# Altium schematic sheet Connectors.SchDoc
size 420 x 297 mm
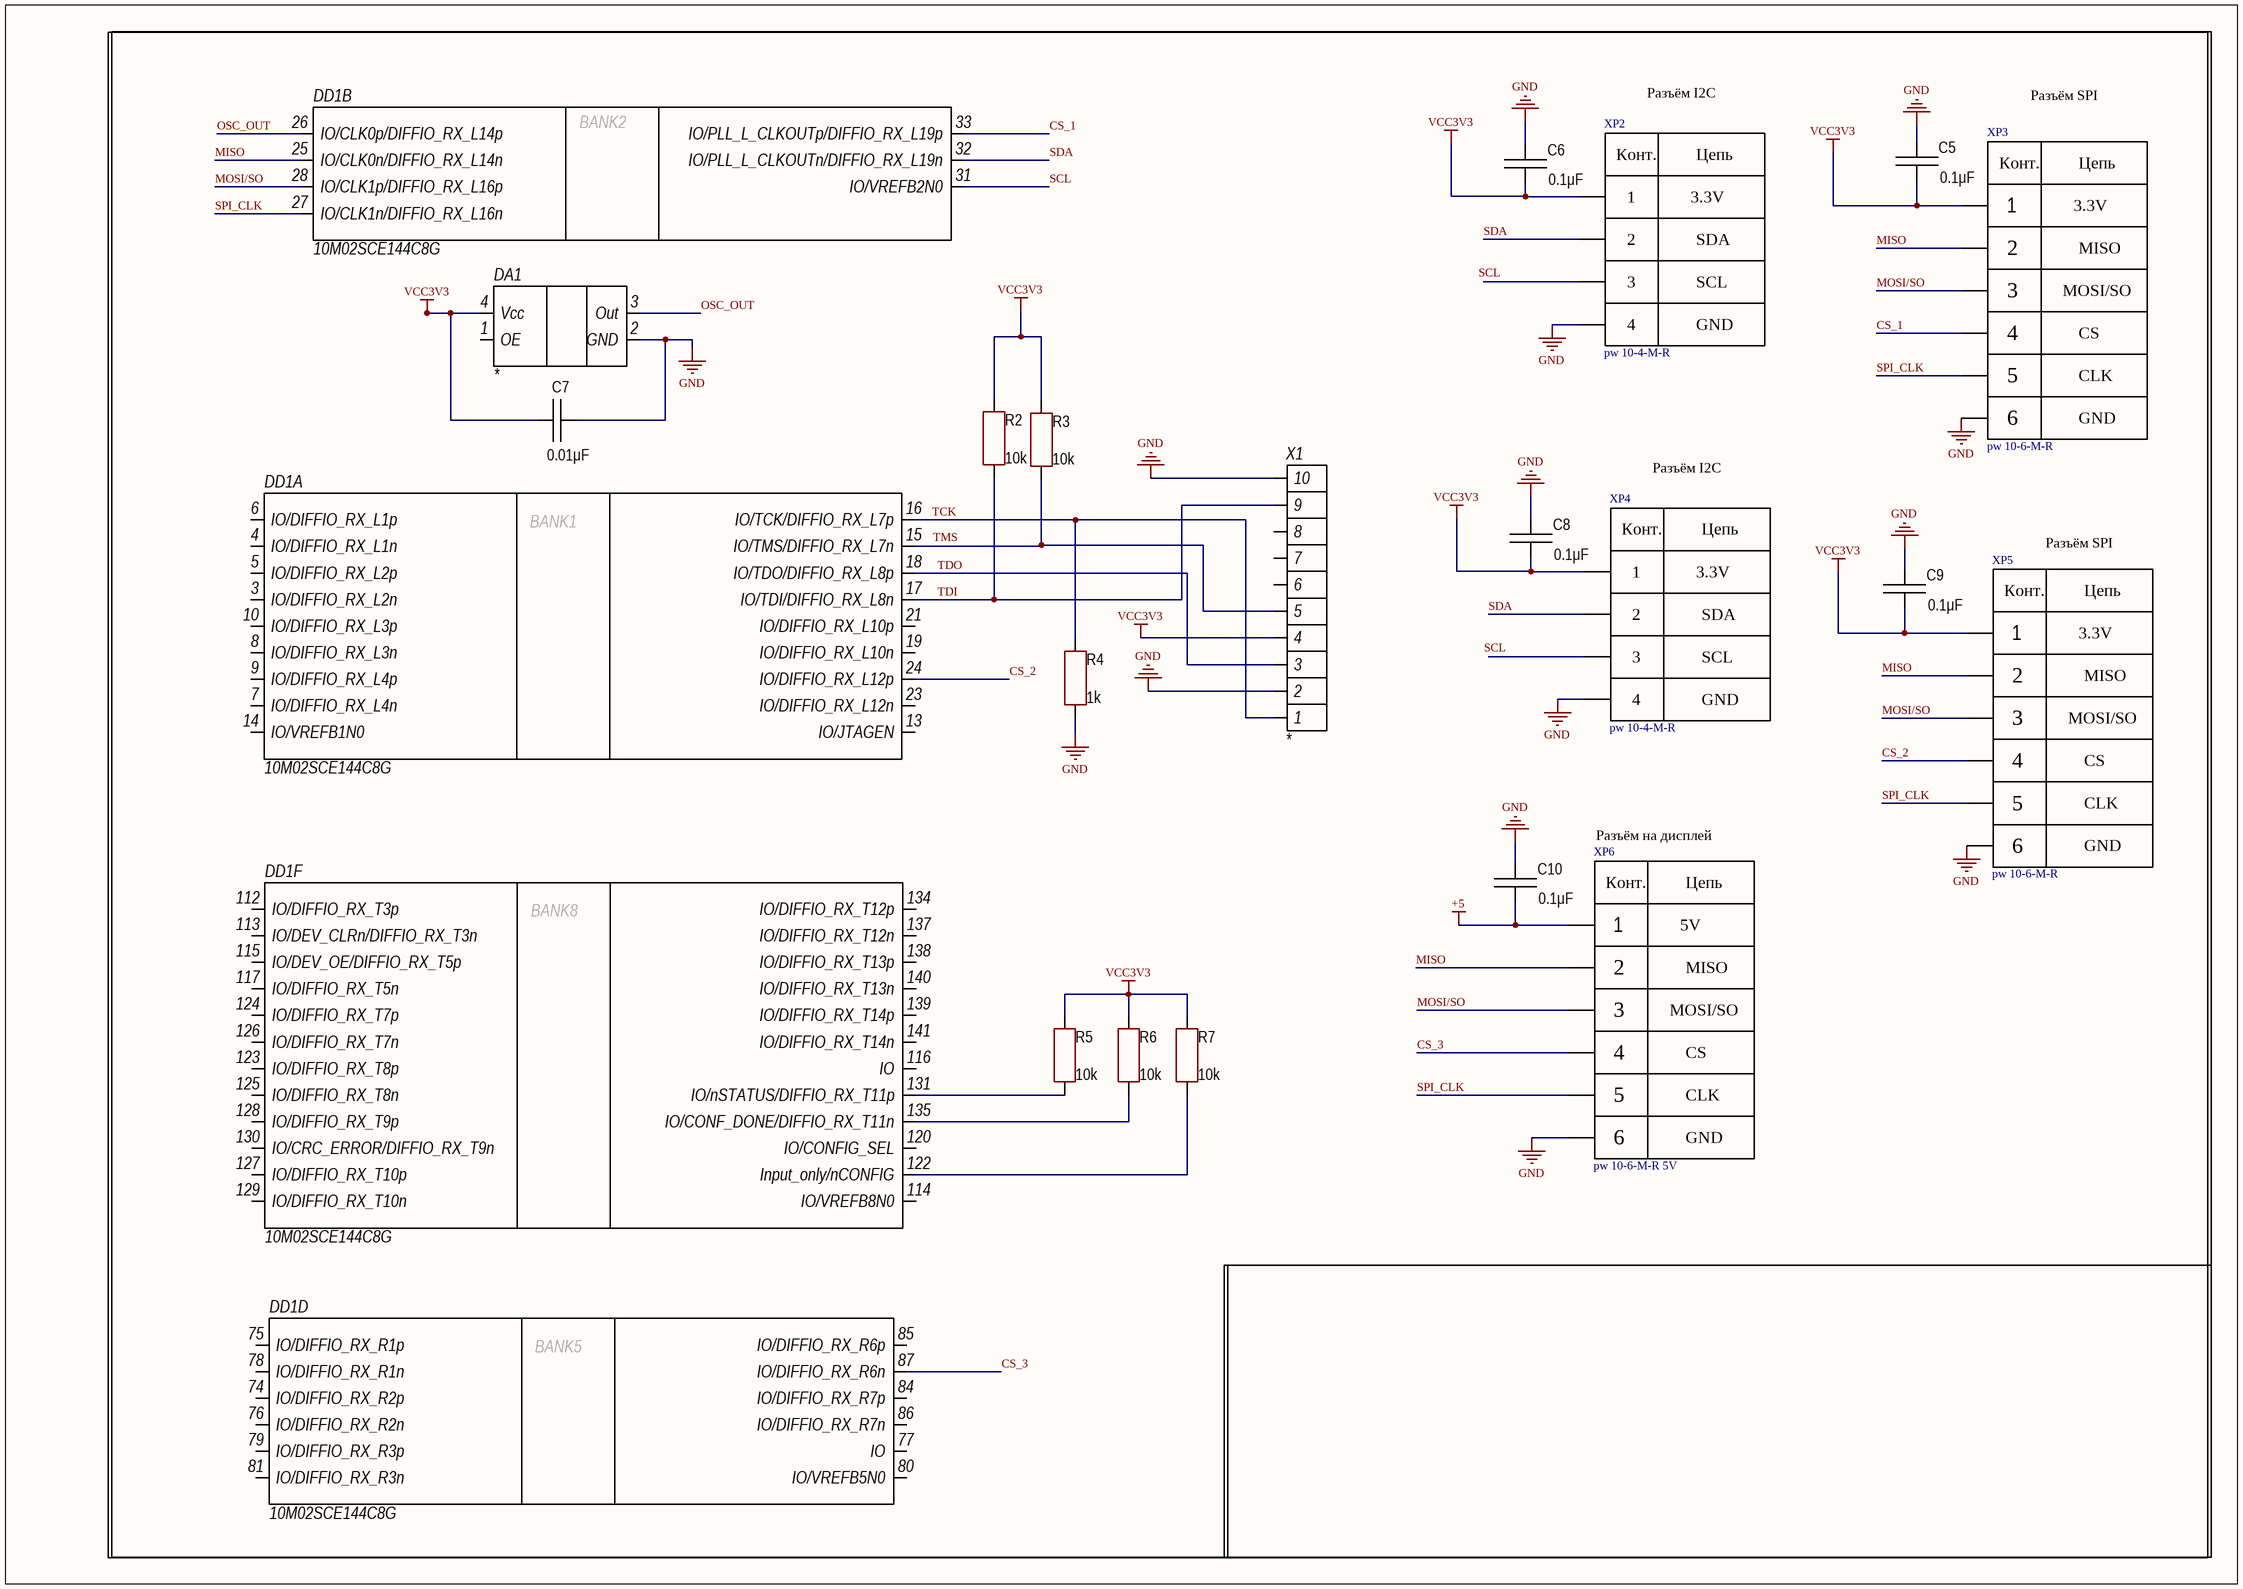
[diagram p0: Connectors.SchDoc]

## Parts
C5  value 0.1μF  [CAP: 0805]
C6  value 0.1μF  [CAP: 0805]
C7  value 0.01μF  [CAP: 0805]
C8  value 0.1μF  [CAP: 0805]
C9  value 0.1μF  [CAP: 0805]
C10  value 0.1μF  [CAP: 0805]
DA1  *  [4-SMD, NO LEAD]
DD1  10M02SCE144C8G  [144-Lead EQFP]  (parts A,B,D,F of 7)
R2  value 10k  [RES: 0805]
R3  value 10k  [RES: 0805]
R4  value 1k  [RES: 0805]
R5  value 10k  [RES: 0805]
R6  value 10k  [RES: 0805]
R7  value 10k  [RES: 0805]
X1  *  [IDC-10MS]
XP2  pw 10-4-M-R  [PW 10-4 - M - R]
XP3  pw 10-6-M-R  [PW 10-6-M]
XP4  pw 10-4-M-R  [PW 10-4 - M - R]
XP5  pw 10-6-M-R  [PW 10-6-M]
XP6  pw 10-6-M-R 5V  [PW 10-6-M]

## Nets
+5: C10.1 XP6.1
GND: C5.2 C6.2 C7.1 C8.2 C9.2 C10.2 DA1.2(GND) R4.1 X1.2 X1.10 XP2.4 XP3.6 XP4.4 XP5.6 XP6.6
VCC3V3: C5.1 C6.1 C7.2 C8.1 C9.1 DA1.4(Vcc) R2.2 R3.2 R5.2 R6.2 R7.2 X1.4 XP2.1 XP3.1 XP4.1 XP5.1
CS_1: DD1.33(IO/PLL_L_CLKOUTp/DIFFIO_RX_L19p) XP3.4
CS_2: DD1.24(IO/DIFFIO_RX_L12p) XP5.4
CS_3: DD1.87(IO/DIFFIO_RX_R6n) XP6.4
MISO: DD1.25(IO/CLK0n/DIFFIO_RX_L14n) XP3.2 XP5.2 XP6.2
MOSI/SO: DD1.28(IO/CLK1p/DIFFIO_RX_L16p) XP3.3 XP5.3 XP6.3
OSC_OUT: DA1.3(Out) DD1.26(IO/CLK0p/DIFFIO_RX_L14p)
SCL: DD1.31(IO/VREFB2N0)
SDA: DD1.32(IO/PLL_L_CLKOUTn/DIFFIO_RX_L19n) XP2.2 XP4.2
SPI_CLK: DD1.27(IO/CLK1n/DIFFIO_RX_L16n) XP3.5 XP5.5 XP6.5
TCK: DD1.16(IO/TCK/DIFFIO_RX_L7p) R4.2 X1.1
TDI: DD1.17(IO/TDI/DIFFIO_RX_L8n) R2.1 X1.9
TDO: DD1.18(IO/TDO/DIFFIO_RX_L8p) X1.3
NetDD1_15: DD1.15(IO/TMS/DIFFIO_RX_L7n) R3.1 X1.5
NetDD1_122: DD1.122(Input_only/nCONFIG) R7.1
NetDD1_131: DD1.131(IO/nSTATUS/DIFFIO_RX_T11p) R5.1
NetDD1_135: DD1.135(IO/CONF_DONE/DIFFIO_RX_T11n) R6.1

Not connected (* = marked no-connect by the designer): DA1 1(OE); DD1 3(IO/DIFFIO_RX_L2n) 4(IO/DIFFIO_RX_L1n) 5(IO/DIFFIO_RX_L2p) 6(IO/DIFFIO_RX_L1p) 7(IO/DIFFIO_RX_L4n) 8(IO/DIFFIO_RX_L3n) 9(IO/DIFFIO_RX_L4p) 10(IO/DIFFIO_RX_L3p) 13(IO/JTAGEN) 14(IO/VREFB1N0) 19(IO/DIFFIO_RX_L10n) 21(IO/DIFFIO_RX_L10p) 23(IO/DIFFIO_RX_L12n) 74(IO/DIFFIO_RX_R2p) 75(IO/DIFFIO_RX_R1p) 76(IO/DIFFIO_RX_R2n) 77(IO) 78(IO/DIFFIO_RX_R1n) 79(IO/DIFFIO_RX_R3p) 80(IO/VREFB5N0) 81(IO/DIFFIO_RX_R3n) 84(IO/DIFFIO_RX_R7p) 85(IO/DIFFIO_RX_R6p) 86(IO/DIFFIO_RX_R7n) 112(IO/DIFFIO_RX_T3p) 113(IO/DEV_CLRn/DIFFIO_RX_T3n) 114(IO/VREFB8N0) 115(IO/DEV_OE/DIFFIO_RX_T5p) 116(IO) 117(IO/DIFFIO_RX_T5n) 120(IO/CONFIG_SEL) 123(IO/DIFFIO_RX_T8p) 124(IO/DIFFIO_RX_T7p) 125(IO/DIFFIO_RX_T8n) 126(IO/DIFFIO_RX_T7n) 127(IO/DIFFIO_RX_T10p) 128(IO/DIFFIO_RX_T9p) 129(IO/DIFFIO_RX_T10n) 130(IO/CRC_ERROR/DIFFIO_RX_T9n) 134(IO/DIFFIO_RX_T12p) 137(IO/DIFFIO_RX_T12n) 138(IO/DIFFIO_RX_T13p) 139(IO/DIFFIO_RX_T14p) 140(IO/DIFFIO_RX_T13n) 141(IO/DIFFIO_RX_T14n); X1 6 7 8; XP2 3; XP4 3

## Notes on the sheet
- Разъём I2C
- Разъём SPI
- Разъём на дисплей
- Labels drawn without touching a wire or pin: SCL, TMS
- (in symbol 10M02SCE144C8G, part A) BANK1
- (in symbol 10M02SCE144C8G, part B) BANK2
- (in symbol 10M02SCE144C8G, part D) BANK5
- (in symbol 10M02SCE144C8G, part F) BANK8
- (in symbol pw 10-4-M-R) Конт.; Цепь; 3.3V; SDA; SCL; GND
- (in symbol pw 10-6-M-R) Конт.; Цепь; 3.3V; MISO; MOSI/SO; CS; CLK; GND
- (in symbol pw 10-6-M-R 5V) Конт.; Цепь; 5V; MISO; MOSI/SO; CS; CLK; GND

## Library data of the parts
C5 C6 C8-C10 = Ceramic_0805: ValueManufacturerPartNumber: Ceramic capacitor, 0.1μF, X7R, , , 0805,; TypeCapacitor: Ceramic capacitor; TypeDielectric: X7R; Package: 0805
C7 = Ceramic_0805: ValueManufacturerPartNumber: Ceramic capacitor, 0.01μF, X7R, , , 0805,; TypeCapacitor: Ceramic capacitor; TypeDielectric: X7R; Package: 0805
DA1 = SG 8002: Oscillator; Manufacturer: EPSON; HelpUrl: https://support.epson.biz/td/api/doc_check.php?dl=brief_SG-8002CA&lang=en; PartNumber: *; Value: *
DD1 = 10M02SCE144C8G: MAX10 FPGA; Manufacturer: Intel; Value: 10M02SCE144C8G; HelpUrl: https://www.digikey.com/product-detail/en/intel/10M02SCE144C8G/544-3098-ND/5284822; PartNumber: 10M02SCE144C8G
R2 R3 R5-R7 = Resistor_0805: ValueManufacturerPartNumber: Resistor film, 10k, , 0805, ,; TypeResistor: Resistor film; Package: 0805
R4 = Resistor_0805: ValueManufacturerPartNumber: Resistor film, 1k, , 0805, ,; TypeResistor: Resistor film; Package: 0805
X1 = Connector 10-pin: Connector; Manufacturer: *; Value: *